# Altium project FKS-V2.3.PRJPCB
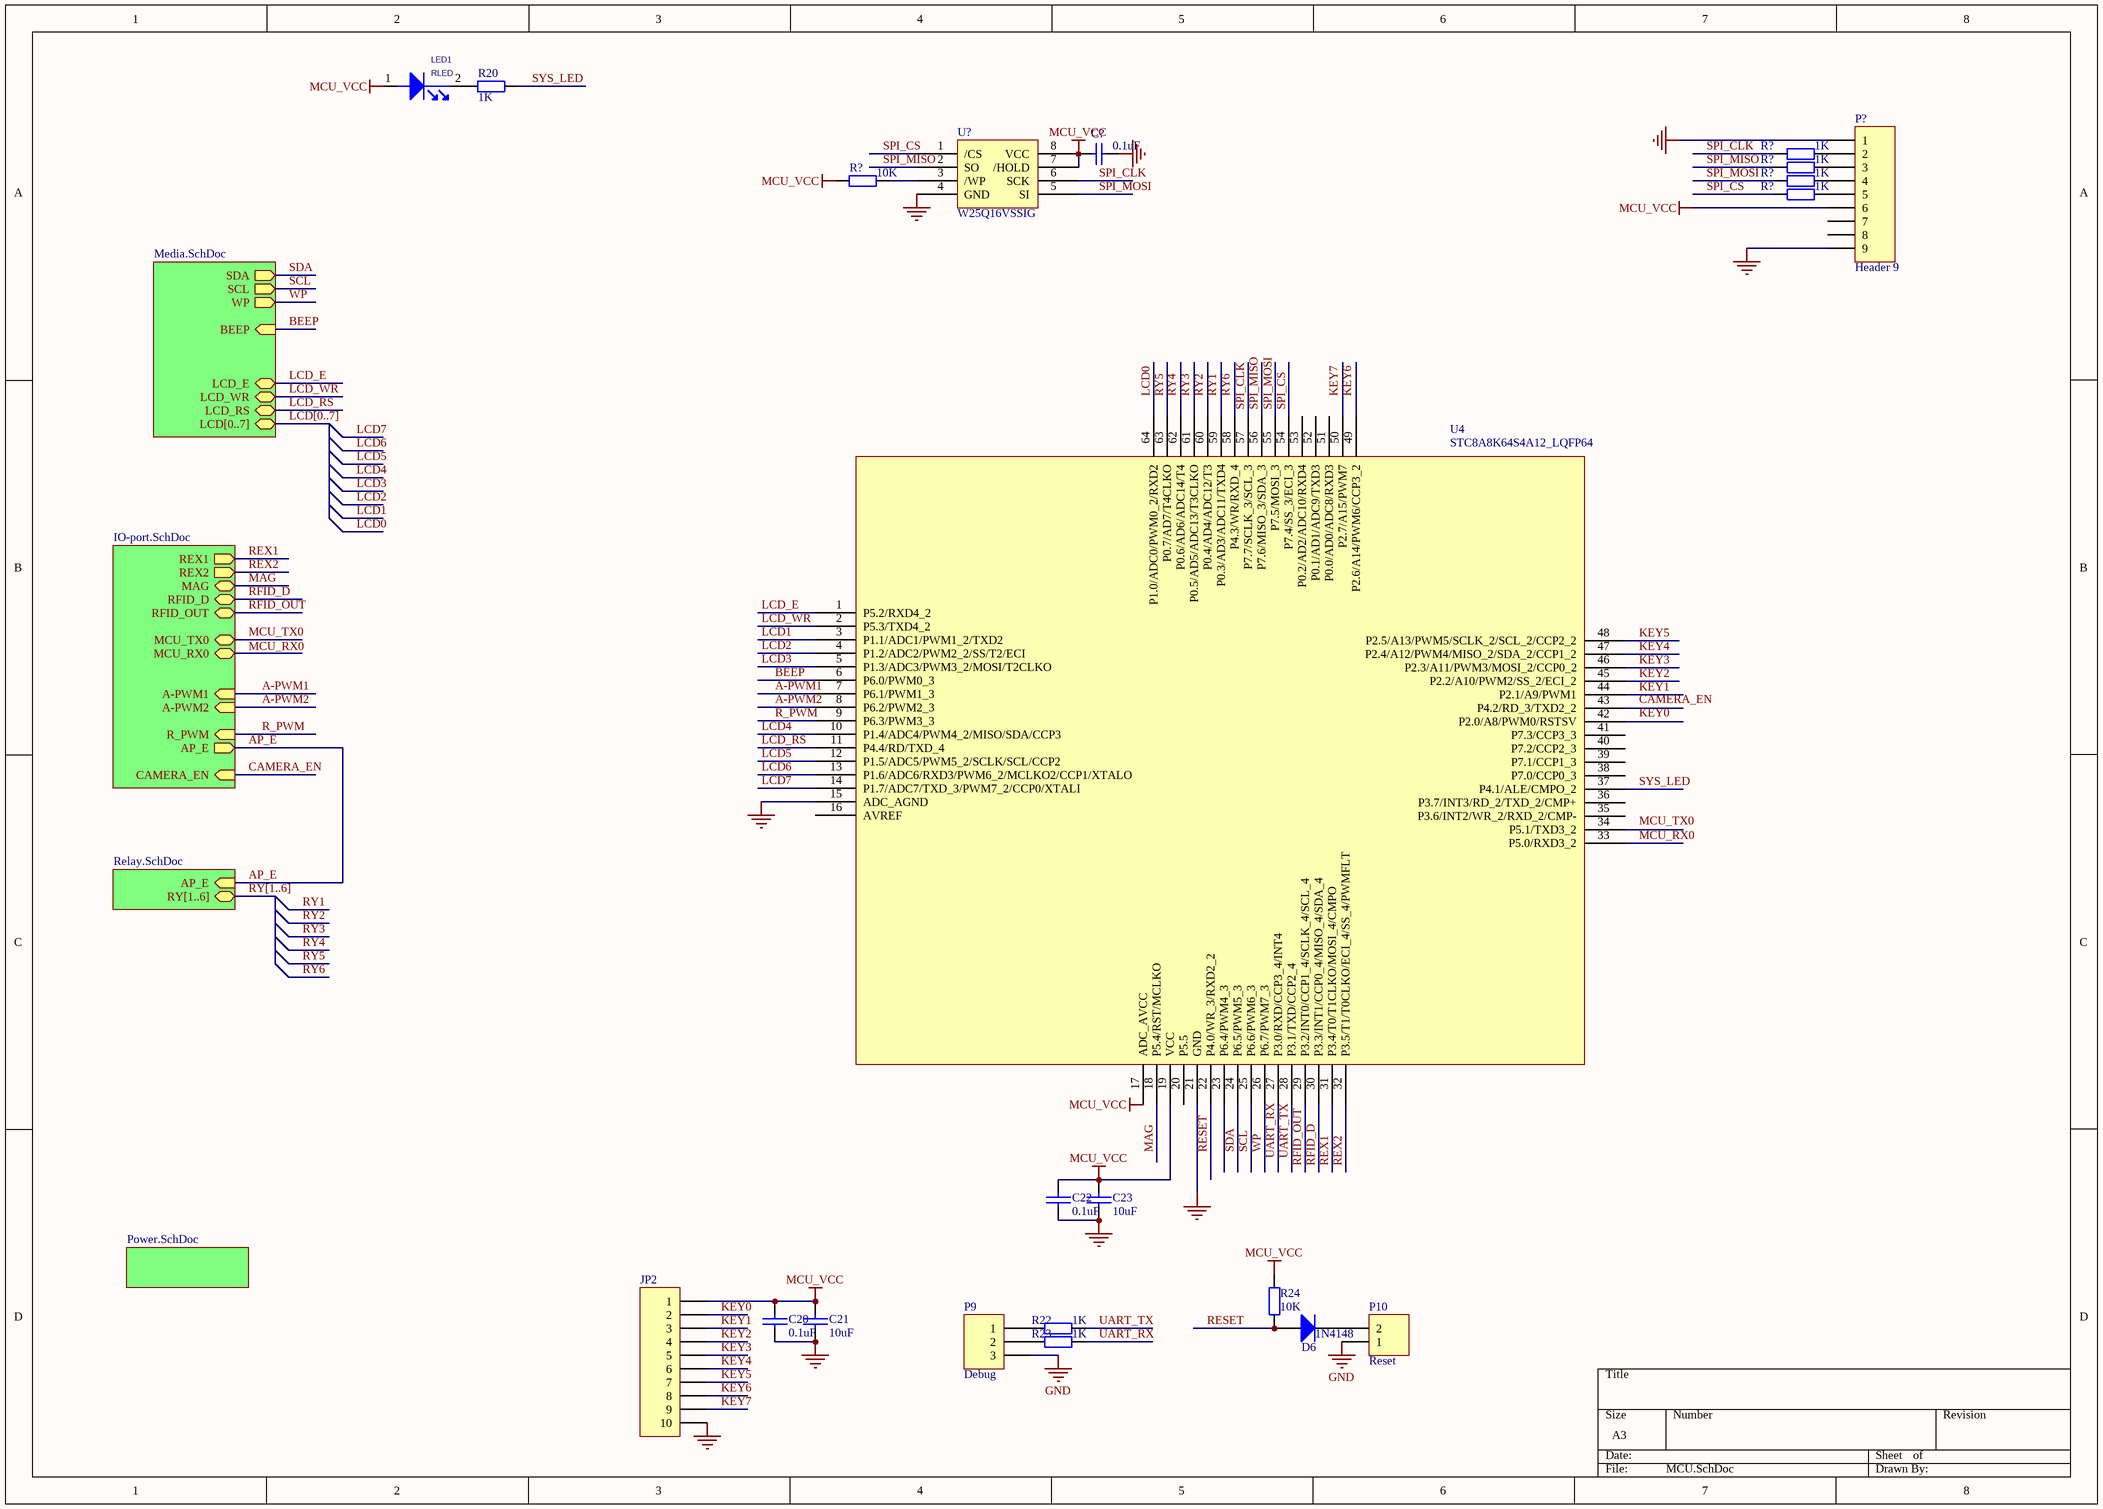
[diagram p0: MCU.SchDoc]
6 sheets, 181 parts. Net scope: hierarchical (ports join the sheet entries above them; power ports are global).
Sheets:
  MCU.SchDoc
    Media = Media.SchDoc
    Media = Power.SchDoc
    IO-port = IO-port.SchDoc
    Media = Relay.SchDoc
      RelayA1 = RelayA.SchDoc
      RelayA2 = RelayA.SchDoc
      RelayA3 = RelayA.SchDoc
      RelayA4 = RelayA.SchDoc
      RelayA5 = RelayA.SchDoc
      RelayA6 = RelayA.SchDoc
      RelayA7 = RelayA.SchDoc
      RelayA8 = RelayA.SchDoc
      RelayA9 = RelayA.SchDoc
      RelayA10 = RelayA.SchDoc
      RelayA11 = RelayA.SchDoc
      RelayA12 = RelayA.SchDoc
      RelayA13 = RelayA.SchDoc
      RelayA14 = RelayA.SchDoc
      RelayA15 = RelayA.SchDoc
      RelayA16 = RelayA.SchDoc

## Sheet MCU.SchDoc
size A3

### Parts
(Parts that share a designator on the sheet are numbered #1, #2 ... from top to bottom, then left to right.)
C20  0.1uF  [C0603]
C21  10uF  [C0603]
C22  0.1uF  [C0603]
C23  10uF  [C0603]
C?#1  0.1uF  [C0603]
D6  1N4148  [SO-G2]
JP2  (no value)  [HDR1X10]
LED1  RLED  [L0603A]
P9  Debug  [HDR1X3]
P10  Reset  [HDR1X2]
P?#1  Header 9  [HDR1X9]
R20  value 1K  [R1608-0603]  (hidden comment: 10K)
R22  1K  [R1608-0603]
R23  1K  [R1608-0603]
R24  value 10K  [R0603]
R?#1  1K  [R0603]
R?#2  1K  [R0603]
R?#3  10K  [R0603]
R?#4  1K  [R0603]
R?#5  1K  [R0603]
U4  STC8A8K64S4A12_LQFP64  [LQFP64]
U?#1  W25Q16VSSIG  [SOP8L]

### Sub-sheets
IO-port = IO-port.SchDoc: REX1 (out), RFID_OUT, MAG, MCU_TX0, MCU_RX0, AP_E (out), CAMERA_EN (in), A-PWM1 (in), A-PWM2 (in), R_PWM (in), REX2 (out), RFID_D
Media = Media.SchDoc: SDA (out), SCL (out), WP (out), LCD_E (bidir), LCD_WR (bidir), LCD_RS (bidir), LCD[0..7] (bidir), BEEP (in)
Media = Power.SchDoc: no entries
Media = Relay.SchDoc: RY[1..6] (bidir), AP_E (in)

### Nets
GND: C20.2 C21.2 C22.2 C23.2 C?#1.1 JP2.10 P9.3 P10.1 P?#1.1 P?#1.9 U4.15(ADC_AGND) U4.21(GND) U?#1.4(GND)
MCU_VCC: C20.1 C21.1 C22.1 C23.1 C?#1.2 JP2.1 LED1.1(ANODE) P?#1.6 R24.1 R?#3.2 U4.17(ADC_AVCC) U4.19(VCC) U?#1.7(/HOLD) U?#1.8(VCC)
A-PWM1: U4.7(P6.1/PWM1_3) ; sheet IO-port/A-PWM1
A-PWM2: U4.8(P6.2/PWM2_3) ; sheet IO-port/A-PWM2
AP_E: sheet IO-port/AP_E, sheet Media/AP_E
BEEP: U4.6(P6.0/PWM0_3) ; sheet Media/BEEP
KEY0: JP2.2
KEY1: JP2.3 U4.44(P2.1/A9/PWM1)
KEY2: JP2.4 U4.45(P2.2/A10/PWM2/SS_2/ECI_2)
KEY3: JP2.5 U4.46(P2.3/A11/PWM3/MOSI_2/CCP0_2)
KEY4: JP2.6 U4.47(P2.4/A12/PWM4/MISO_2/SDA_2/CCP1_2)
KEY5: JP2.7 U4.48(P2.5/A13/PWM5/SCLK_2/SCL_2/CCP2_2)
KEY6: JP2.8
KEY7: JP2.9
LCD0: U4.64(P1.0/ADC0/PWM0_2/RXD2)
LCD1: U4.3(P1.1/ADC1/PWM1_2/TXD2)
LCD2: U4.4(P1.2/ADC2/PWM2_2/SS/T2/ECI)
LCD3: U4.5(P1.3/ADC3/PWM3_2/MOSI/T2CLKO)
LCD4: U4.10(P1.4/ADC4/PWM4_2/MISO/SDA/CCP3)
LCD5: U4.12(P1.5/ADC5/PWM5_2/SCLK/SCL/CCP2)
LCD6: U4.13(P1.6/ADC6/RXD3/PWM6_2/MCLKO2/CCP1/XTALO)
LCD7: U4.14(P1.7/ADC7/TXD_3/PWM7_2/CCP0/XTALI)
LCD_E: U4.1(P5.2/RXD4_2) ; sheet Media/LCD_E
LCD_RS: U4.11(P4.4/RD/TXD_4) ; sheet Media/LCD_RS
LCD_WR: U4.2(P5.3/TXD4_2) ; sheet Media/LCD_WR
MAG: U4.18(P5.4/RST/MCLKO) ; sheet IO-port/MAG
MCU_RX0: U4.33(P5.0/RXD3_2)
R_PWM: U4.9(P6.3/PWM3_3) ; sheet IO-port/R_PWM
RESET: D6.A R24.2 U4.22(P4.0/WR_3/RXD2_2)
REX1: U4.31(P3.4/T0/T1CLKO/MOSI_4/CMPO) ; sheet IO-port/REX1
REX2: U4.32(P3.5/T1/T0CLKO/ECI_4/SS_4/PWMFLT) ; sheet IO-port/REX2
RFID_D: U4.30(P3.3/INT1/CCP0_4/MISO_4/SDA_4) ; sheet IO-port/RFID_D
RFID_OUT: U4.29(P3.2/INT0/CCP1_4/SCLK_4/SCL_4) ; sheet IO-port/RFID_OUT
RY5: U4.63(P0.7/AD7/T4CLKO)
SCL: U4.25(P6.6/PWM6_3) ; sheet Media/SCL
SDA: U4.24(P6.5/PWM5_3) ; sheet Media/SDA
SPI_CLK: R?#1.2 U4.57(P7.7/SCLK_3/SCL_3) U?#1.6(SCK)
SPI_CS: R?#5.2 U?#1.1(/CS)
SPI_MISO: R?#2.2 U4.56(P7.6/MISO_3/SDA_3) U?#1.2(SO)
SPI_MOSI: R?#4.2 U?#1.5(SI)
SYS_LED: R20.2 U4.37(P4.1/ALE/CMPO_2)
UART_RX: R23.1 U4.27(P3.0/RXD/CCP3_4/INT4)
UART_TX: R22.1 U4.28(P3.1/TXD/CCP2_4)
WP: U4.26(P6.7/PWM7_3) ; sheet Media/WP
NetD6_K: D6.K P10.2
NetLED1_2: LED1.2(CATHODE) R20.1
NetP9_1: P9.1 R22.2
NetP9_2: P9.2 R23.2
NetP?#1_2: P?#1.2 R?#1.1
NetP?#1_3: P?#1.3 R?#2.1
NetP?#1_4: P?#1.4 R?#4.1
NetP?#1_5: P?#1.5 R?#5.1
NetR?#3_1: R?#3.1 U?#1.3(/WP)

Not connected (* = marked no-connect by the designer): P?#1 7 8; U4 16(AVREF) 20(P5.5) 23(P6.4/PWM4_3) 34(P5.1/TXD3_2) 35(P3.6/INT2/WR_2/RXD_2/CMP-) 36(P3.7/INT3/RD_2/TXD_2/CMP+) 38(P7.0/CCP0_3) 39(P7.1/CCP1_3) 40(P7.2/CCP2_3) 41(P7.3/CCP3_3) 42(P2.0/A8/PWM0/RSTSV) 43(P4.2/RD_3/TXD2_2) 49(P2.6/A14/PWM6/CCP3_2) 50(P2.7/A15/PWM7) 51(P0.0/AD0/ADC8/RXD3) 52(P0.1/AD1/ADC9/TXD3) 53(P0.2/AD2/ADC10/RXD4) 54(P7.4/SS_3/ECI_3) 55(P7.5/MOSI_3) 58(P4.3/WR/RXD_4) 59(P0.3/AD3/ADC11/TXD4) 60(P0.4/AD4/ADC12/T3) 61(P0.5/AD5/ADC13/T3CLKO) 62(P0.6/AD6/ADC14/T4)

### Buses and harness runs
bus LCD[0..7] = sheet Media/LCD[0..7]
bus RY[1..6] = sheet Media/RY[1..6]

### Notes on the sheet
- Labels drawn without touching a wire or pin: CAMERA_EN, KEY0, KEY6, KEY7, MCU_RX0, MCU_TX0, RY1, RY2, RY3, RY4, RY6, SPI_CS, SPI_MOSI

### Library data of the parts
C20-C23 = CAP: Capacitor
  C20 C22: Value: 0.1uF
  C21 C23: Value: 10uF
C?#1 = Cap Semi: Capacitor (Semiconductor SIM Model); Published: 8-Jun-2000; LatestRevisionDate: 29-May-2009; LatestRevisionNote: IPC-7351 Footprint Added.; PackageReference: C1206; Publisher: Altium Limited; PackageDescription: Chip Capacitor; Value: 0.1uF
D6 = Diode 1N4001: 1 Amp General Purpose Rectifier; Published: 8-Jun-2000; LatestRevisionDate: 17-Jul-2002; LatestRevisionNote: Re-released for DXP Platform.; DatasheetVersion: 1998; PackageVersion: Aug-1999; PackageReference: DO-41; Publisher: Altium Limited; PackageDescription: Diode, Axial; Body 5.2 x 2.7 mm (LxDia. max), Lead Dia. 0.86 mm (max); Code_JEDEC: DO-204-AL; ComponentLink1Description: Manufacturer Link; ComponentLink1URL: http://www.fairchildsemi.com/; ComponentLink2Description: Datasheet; ComponentLink2URL: http://www.fairchildsemi.com/ds/1N%2F1N4001.pdf
JP2 = Header 10: Header, 10-Pin; LatestRevisionDate: 17-Jul-2002; LatestRevisionNote: Re-released for DXP Platform.; Publisher: Altium Limited
LED1 = LED_2
P9 = Header 3: Header, 3-Pin; LatestRevisionDate: 17-Jul-2002; LatestRevisionNote: Re-released for DXP Platform.; Publisher: Altium Limited
P10 = Header 2: Header, 2-Pin; LatestRevisionDate: 17-Jul-2002; LatestRevisionNote: Re-released for DXP Platform.; Publisher: Altium Limited
P?#1 = Header 9: Header, 9-Pin; LatestRevisionDate: 17-Jul-2002; LatestRevisionNote: Re-released for DXP Platform.; Publisher: Altium Limited
R20 R24 R?#1-R?#5 = Res2: Resistor; Published: 8-Jun-2000; LatestRevisionDate: 17-Jul-2002; LatestRevisionNote: Re-released for DXP Platform.; PackageReference: AXIAL-0.4; Publisher: Altium Limited
  R24: PackageDescription: Axial Device, Thru-Hole; 2 Leads; 0.4 in Pin Spacing
  R?#1 R?#2 R?#4 R?#5: PackageDescription: Axial Device, Thru-Hole; 2 Leads; 0.4 in Pin Spacing; Value: 1K
  R?#3: PackageDescription: Axial Device, Thru-Hole; 2 Leads; 0.4 in Pin Spacing; Value: 10K
R22 R23 = Res2: Resistor; Value: 2.4K; Published: 8-Jun-2000; LatestRevisionDate: 17-Jul-2002; LatestRevisionNote: Re-released for DXP Platform.; PackageReference: AXIAL-0.4; Publisher: Altium Limited
U?#1 = AT25256A: Serial EEPRom

## Sheet Media.SchDoc
size A4
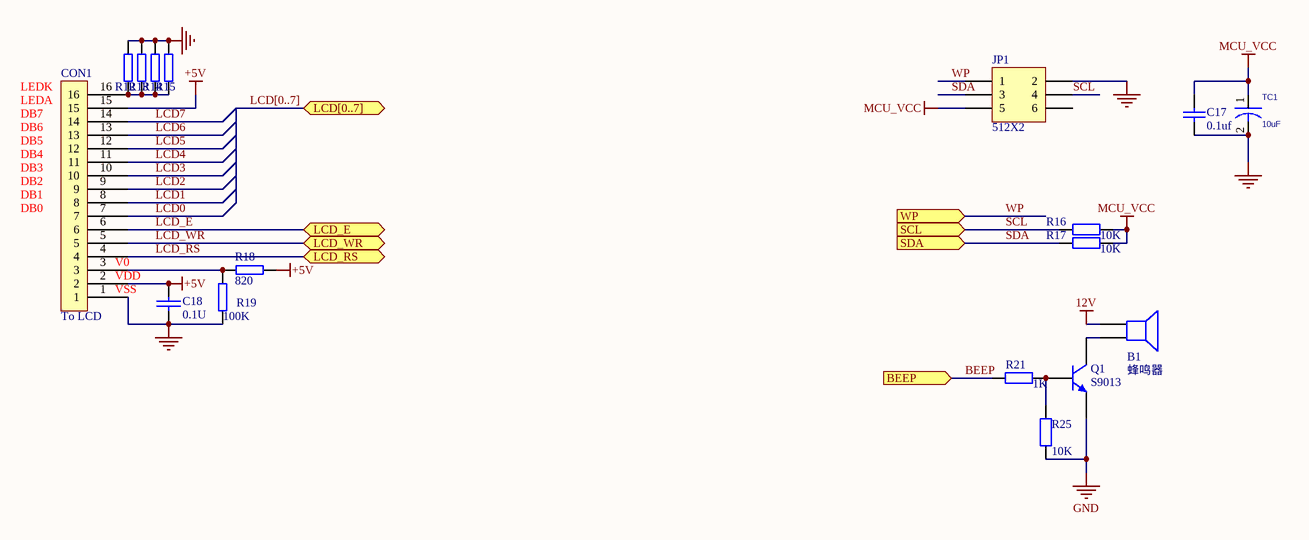
[diagram p1: Media.SchDoc]

### Parts
B1  蜂鸣器  [BP]
C17  0.1uf  [C1608-0603]
C18  0.1U  [c1608-0603]
CON1  To LCD  [RP16]
JP1  512X2  [HDR2X3]
Q1  S9013  [SOT-23]
R12  2K 1/4W  [R3216-1206]  (value not drawn)
R13  2K 1/4W  [R3216-1206]  (value not drawn)
R14  2K 1/4W  [R3216-1206]  (value not drawn)
R15  2K 1/4W  [R3216-1206]  (value not drawn)
R16  value 10K  [0603]
R17  value 10K  [0603]
R18  820  [r1608-0603]
R19  100K  [r1608-0603]
R21  value 1K  [R0603]
R25  value 10K  [R0603]
TC1  10uF  [C2125-0805]

### Ports
BEEP (in), LCD[0..7] (bidir), LCD_E (bidir), LCD_RS (bidir), LCD_WR (bidir), SCL (in), SDA (in), WP (in)

### Nets
12V: B1.1
+5V: C18.1 CON1.2 CON1.15 R18.2
GND: C17.1 C18.2 CON1.1 JP1.2 Q1.1(E) R12.2 R13.2 R14.2 R15.2 R19.2 R25.1 TC1.2
MCU_VCC: C17.2 JP1.5 R16.1 R17.1 TC1.1
BEEP: R21.1 ; port BEEP
LCD0: CON1.7
LCD1: CON1.8
LCD2: CON1.9
LCD3: CON1.10
LCD4: CON1.11
LCD5: CON1.12
LCD6: CON1.13
LCD7: CON1.14
LCD_E: CON1.6 ; port LCD_E
LCD_RS: CON1.4 ; port LCD_RS
LCD_WR: CON1.5 ; port LCD_WR
SCL: JP1.4 R16.2 ; port SCL
SDA: JP1.3 R17.2 ; port SDA
WP: JP1.1 ; port WP
NetB1_2: B1.2 Q1.3(C)
NetCON1_3: CON1.3 R18.1 R19.1
NetCON1_16: CON1.16 R12.1 R13.1 R14.1 R15.1
NetQ1_2: Q1.2(B) R21.2 R25.2

Not connected (* = marked no-connect by the designer): JP1 6

### Buses and harness runs
bus LCD[0..7] = port LCD[0..7]

### Notes on the sheet
- (near CON1) LEDK
- (near CON1) DB4
- (near CON1) DB5
- (near CON1) DB6
- (near CON1) DB7
- (near CON1) LEDA
- (near CON1) DB0
- (near CON1) DB1
- (near CON1) DB2
- (near CON1) DB3
- VSS
- VDD
- (near CON1) V0

### Library data of the parts
B1 = Speaker: Loudspeaker; Published: 24-Mar-1999; LatestRevisionDate: 17-Jul-2002; LatestRevisionNote: Re-released for DXP Platform.; PackageReference: PIN2; Publisher: Altium Limited
C17 = Cap Semi: Capacitor (Semiconductor SIM Model); Value: 22pF; Published: 8-Jun-2000; LatestRevisionDate: 17-Jul-2002; LatestRevisionNote: Re-released for DXP Platform.; PackageReference: C1206; Publisher: Altium Limited
C18 = CAP: Capacitor; Value: 0.1U
CON1 = CON16
JP1 = Header 3X2: Header, 3-Pin, Dual row; LatestRevisionDate: 17-Jul-2002; LatestRevisionNote: Re-released for DXP Platform.; Publisher: Altium Limited
Q1 = 2N3904: NPN General Purpose Amplifier; Published: 8-Jun-2000; LatestRevisionDate: 15-Jan-2003; LatestRevisionNote: PCB Footprint 'BCY-W3/D4.7' replaced; DatasheetVersion: 1997; PackageVersion: Sep-1998; PackageReference: TO-92A; Publisher: Altium Limited; PackageDescription: TO, Flat Index; 3 In-Line, Axial Leads; Body Dia. 4.5mm; Leads 0.51 x 0.48 mm (max); ComponentLink1Description: Manufacturer Link; ComponentLink1URL: http://www.fairchildsemi.com/; ComponentLink2Description: Datasheet; ComponentLink2URL: http://www.fairchildsemi.com/ds/2N%2F2N3904.pdf
R12-R15 R18 R19 = RES9: RES2
  R12-R15: Value: 2K 1/4W
  R18: Value: 820
  R19: Value: 100K
R16 R17 R21 R25 = Res2: Resistor; Published: 8-Jun-2000; LatestRevisionDate: 17-Jul-2002; LatestRevisionNote: Re-released for DXP Platform.; PackageReference: AXIAL-0.4; Publisher: Altium Limited; PackageDescription: Axial Device, Thru-Hole; 2 Leads; 0.4 in Pin Spacing
TC1 = CAP_0

## Sheet Power.SchDoc
size A4
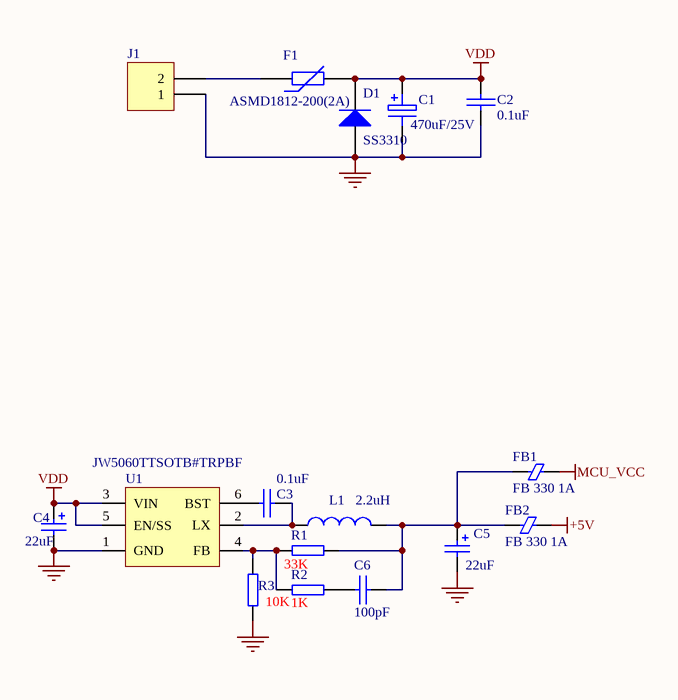
[diagram p2: Power.SchDoc]

### Parts
C1  470uF/25V  [TPC4-M]
C2  0.1uF  [C0603]
C3  0.1uF  [C0603]
C4  22uF  [C0603]
C5  22uF  [C0603]
C6  100pF  [C0603]
D1  SS3310  [SO-0.4]
F1  ASMD1812-200(2A)  [FS1812]
FB1  FB 330 1A  [R0603]
FB2  FB 330 1A  [R0603]
J1  Header 2  [JITE2_1]  (value not drawn)
L1  2.2uH  [2220]
R1  33K  [R0603]
R2  1K  [R0603]
R3  10K  [R0603]
U1  JW5060TTSOTB#TRPBF  [SOT23-6]

### Nets
+5V: FB2.2
GND: C1.2 C2.2 C4.2 C5.2 D1.A J1.1 R3.1 U1.1(GND)
MCU_VCC: FB1.2
VDD: C1.1 C2.1 C4.1 D1.K F1.2 U1.3(VIN) U1.5(EN/SS)
NetC3_1: C3.1 L1.1 U1.2(LX)
NetC3_2: C3.2 U1.6(BST)
NetC5_1: C5.1 C6.2 FB1.1 FB2.1 L1.2 R1.1
NetC6_1: C6.1 R2.1
NetF1_1: F1.1 J1.2
NetR1_2: R1.2 R2.2 R3.2 U1.4(FB)

### Library data of the parts
C1 = ELECTRO1: Electrolytic Capacitor; Value: 470uF/25V
C2 C3 C6 = CAP: Capacitor
  C2 C3: Value: 0.1uF
  C6: Value: 100pF
C4 C5 = Cap Pol2: Polarized Capacitor (Axial); Published: 8-Jun-2000; LatestRevisionDate: 17-Jul-2002; LatestRevisionNote: Re-released for DXP Platform.; PackageReference: POLAR0.8; Publisher: Altium Limited; Value: 22uF
D1 = Diode: Default Diode; Published: 8-Jun-2000; LatestRevisionDate: 17-Jul-2002; LatestRevisionNote: Re-released for DXP Platform.; PackageVersion: Sep-1996; PackageReference: SMC; Publisher: Altium Limited; PackageDescription: DO-214-AB/SMC; 2 C-Bend Leads; Body 7.9 x 5.9 mm, inc. leads (LxW); Code_JEDEC: DO-214-AB
F1 = Res Varistor: Varistor (Voltage-Sensitive Resistor); Published: 24-Mar-1999; LatestRevisionDate: 29-May-2009; LatestRevisionNote: IPC-7351 Footprint Added.; PackageVersion: Mar-2003; PackageReference: 6-0805; Publisher: Altium Limited; PackageDescription: Chip Resistor 0805 Case Size; Code_IPC: RESC2012
FB1 FB2 = FB: 磁珠电感100M
J1 = Header 2: Header, 2-Pin; LatestRevisionDate: 17-Jul-2002; LatestRevisionNote: Re-released for DXP Platform.; Publisher: Altium Limited
L1 = L: MS74-150MT; 型号: 2.2uH
R1-R3 = RES9: RES2
  R1: Value: 33K
  R2: Value: 1K
  R3: Value: 10K
U1 = XC9280

## Sheet IO-port.SchDoc
size A4
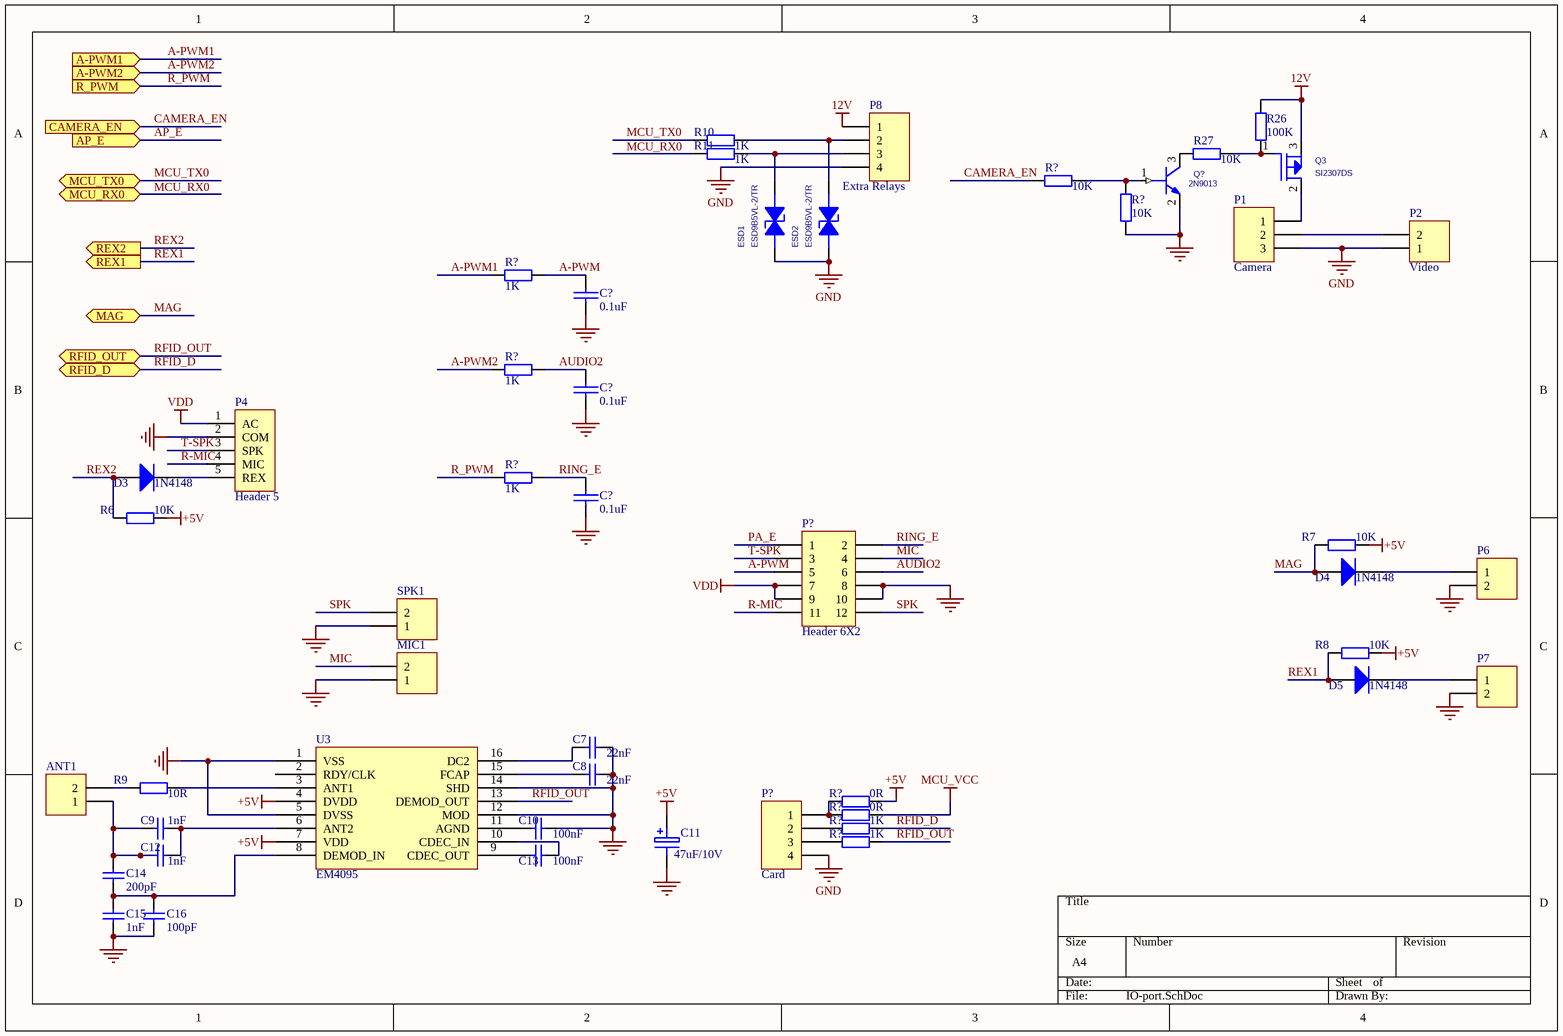
[diagram p3: IO-port.SchDoc]

### Parts
(Parts that share a designator on the sheet are numbered #1, #2 ... from top to bottom, then left to right.)
ANT1  (no value)  [SIP2]
C7  22nF  [C1608-0603]
C8  22nF  [C1608-0603]
C9  1nF  [C1608-0603]
C10  100nF  [C1608-0603]
C11  47uF/10V  [TPC4-M]
C12  1nF  [C1608-0603]
C13  100nF  [C1608-0603]
C14  200pF  [C1608-0603]
C15  1nF  [C1608-0603]
C16  100pF  [C1608-0603]
C?#2  0.1uF  [C0603]
C?#3  0.1uF  [C0603]
C?#4  0.1uF  [C0603]
D3  1N4148  [SO-G2]
D4  1N4148  [SO-G2]
D5  1N4148  [SO-G2]
ESD1  ESD9B5VL-2/TR  [SOD-323]
ESD2  ESD9B5VL-2/TR  [SOD-323]
MIC1  (no value)  [HDR1X2]
P1  Camera  [HDR1X3]
P2  Video  [SIP2]
P4  Header 5  [HDR1X5]
P6  Header 2  [SIP2]  (value not drawn)
P7  Header 2  [SIP2]  (value not drawn)
P8  Extra Relays  [SIP4]
P?#2  Header 6X2  [HDR2X6]
P?#3  Card  [HDR1X4]
Q3  SI2307DS  [SOT-23]
Q?#1  2N9013  [SOT-23]
R6  10K  [R1608-0603]
R7  10K  [R1608-0603]
R8  10K  [R1608-0603]
R9  value 10R  [R0603]
R10  value 1K  [R0603]
R11  value 1K  [R0603]
R26  value 100K  [R0603]
R27  value 10K  [R0603]
R?#6  value 10K  [R0603]
R?#7  value 10K  [R0603]
R?#8  value 1K  [R0603]
R?#9  value 1K  [R0603]
R?#10  value 1K  [R0603]
R?#11  0R  [R1608-0603]
R?#12  0R  [R1608-0603]
R?#13  1K  [R1608-0603]
R?#14  1K  [R1608-0603]
SPK1  (no value)  [HDR1X2]
U3  EM4095  [SOP16]

### Ports
A-PWM1 (in), A-PWM2 (in), AP_E (in), CAMERA_EN (in), MAG (bidir), MCU_RX0 (bidir), MCU_TX0 (bidir), R_PWM (in), REX1 (out), REX2 (out), RFID_D (bidir), RFID_OUT (bidir)

### Nets
12V: P8.1 Q3.3(SOURCE) R26.2
+5V: C11.1 R6.2 R7.2 R8.2 R?#11.1 U3.4(DVDD) U3.7(VDD)
GND: C7.1 C8.1 C10.1 C11.2 C15.2 C16.2 C?#2.2 C?#3.2 C?#4.2 ESD1.2(CATHODE) ESD2.2(CATHODE) MIC1.1 P1.3 P2.1 P4.2(COM) P6.2 P7.2 P8.4 P?#2.8 P?#2.10 P?#3.4 Q?#1.2(E) R?#7.1 SPK1.1 U3.1(VSS) U3.5(DVSS) U3.12(MOD) U3.14(SHD)
MCU_VCC: R?#12.1
VDD: P4.1(AC) P?#2.7 P?#2.9
A-PWM: C?#2.1 P?#2.5 R?#8.1
A-PWM1: R?#8.2 ; port A-PWM1
A-PWM2: R?#9.2 ; port A-PWM2
AUDIO2: C?#3.1 P?#2.6 R?#9.1
CAMERA_EN: R?#6.1 ; port CAMERA_EN
MAG: D4.A R7.1 ; port MAG
MCU_TX0: R10.1 ; port MCU_TX0
MIC: MIC1.2 P?#2.4
PA_E: P?#2.1
R-MIC: P4.4(MIC) P?#2.11
R_PWM: R?#10.2 ; port R_PWM
REX1: D5.A R8.1 ; port REX1
REX2: D3.A R6.1 ; port REX2
RFID_D: R?#13.1 ; port RFID_D
RFID_OUT: R?#14.1 U3.13(DEMOD_OUT) ; port RFID_OUT
RING_E: C?#4.1 P?#2.2 R?#10.1
SPK: P?#2.12 SPK1.2
T-SPK: P4.3(SPK) P?#2.3
NetANT1_1: ANT1.1 C9.2 C12.2 C14.1
NetANT1_2: ANT1.2 R9.2
NetC7_2: C7.2 U3.16(DC2)
NetC8_2: C8.2 U3.15(FCAP)
NetC9_1: C9.1 C12.1 U3.6(ANT2)
NetC10_2: C10.2 U3.11(AGND)
NetC13_1: C13.1 U3.10(CDEC_IN)
NetC13_2: C13.2 U3.9(CDEC_OUT)
NetC14_2: C14.2 C15.1 C16.1 U3.8(DEMOD_IN)
NetD3_K: D3.K P4.5(REX)
NetD4_K: D4.K P6.1
NetD5_K: D5.K P7.1
NetESD1_1: ESD1.1(ANODE) P8.3 R11.2
NetESD2_1: ESD2.1(ANODE) P8.2 R10.2
NetP1_1: P1.1 Q3.2(DRAIN)
NetP1_2: P1.2 P2.2
NetP?#3_1: P?#3.1 R?#11.2 R?#12.2
NetP?#3_2: P?#3.2 R?#13.2
NetP?#3_3: P?#3.3 R?#14.2
NetQ3_1: Q3.1(GATE) R26.1 R27.2
NetQ?#1_1: Q?#1.1(B) R?#6.2 R?#7.2
NetQ?#1_3: Q?#1.3(C) R27.1
NetR9_1: R9.1 U3.3(ANT1)

Not connected (* = marked no-connect by the designer): R11 1; U3 2(RDY/CLK)

### Notes on the sheet
- Labels drawn without touching a wire or pin: MCU_RX0

### Library data of the parts
ANT1 MIC1 P2 P6 P7 SPK1 = Header 2: Header, 2-Pin; LatestRevisionDate: 17-Jul-2002; LatestRevisionNote: Re-released for DXP Platform.; Publisher: Altium Limited
C7-C10 C12-C16 = Cap Semi: as C17 on sheet Media; Published: 8-Jun-2000; LatestRevisionDate: 17-Jul-2002; LatestRevisionNote: Re-released for DXP Platform.; PackageReference: C1206; Publisher: Altium Limited
C11 = ELECTRO1: Electrolytic Capacitor; Value: 47uF/10V
C?#2-C?#4 = CAP: Capacitor; Value: 0.1uF
D3-D5 = Diode 1N4148: High Conductance Fast Diode; Published: 8-Jun-2000; LatestRevisionDate: 17-Jul-2002; LatestRevisionNote: Re-released for DXP Platform.; DatasheetVersion: 1997; PackageReference: DO-35; Publisher: Altium Limited; PackageDescription: Diode, Axial; Body 3.8 x 1.9 mm (LxDia. max), Lead Dia. 0.53 mm (max); Code_JEDEC: DO-204-AH; ComponentLink1Description: Manufacturer Link; ComponentLink1URL: http://www.fairchildsemi.com/; ComponentLink2Description: Datasheet; ComponentLink2URL: http://www.fairchildsemi.com/ds/1N%2F1N4148.pdf
ESD1 ESD2 = 1_1.5KE100A_Dup1: 1ST PART DESCRIPTION: WILL ESD9B5V Bidirection ESD Protection
P1 = Header 3: Header, 3-Pin; LatestRevisionDate: 17-Jul-2002; LatestRevisionNote: Re-released for DXP Platform.; Publisher: Altium Limited
P4 = Header 5: Header, 5-Pin; LatestRevisionDate: 17-Jul-2002; LatestRevisionNote: Re-released for DXP Platform.; Publisher: Altium Limited
P8 P?#3 = Header 4: Header, 4-Pin; LatestRevisionDate: 17-Jul-2002; LatestRevisionNote: Re-released for DXP Platform.; Publisher: Altium Limited
P?#2 = Header 6X2: Header, 6-Pin, Dual row; LatestRevisionDate: 17-Jul-2002; LatestRevisionNote: Re-released for DXP Platform.; Publisher: Altium Limited
Q3 = MOSFET P_1
Q?#1 = NPN_0
R6-R8 R?#11-R?#14 = Res2: Resistor; Value: 2.4K; Published: 8-Jun-2000; LatestRevisionDate: 17-Jul-2002; LatestRevisionNote: Re-released for DXP Platform.; PackageReference: AXIAL-0.4; Publisher: Altium Limited
R9-R11 R26 R27 R?#6-R?#10 = Res2: Resistor; Published: 8-Jun-2000; LatestRevisionDate: 17-Jul-2002; LatestRevisionNote: Re-released for DXP Platform.; PackageReference: AXIAL-0.4; Publisher: Altium Limited; PackageDescription: Axial Device, Thru-Hole; 2 Leads; 0.4 in Pin Spacing

## Sheet Relay.SchDoc
size A4
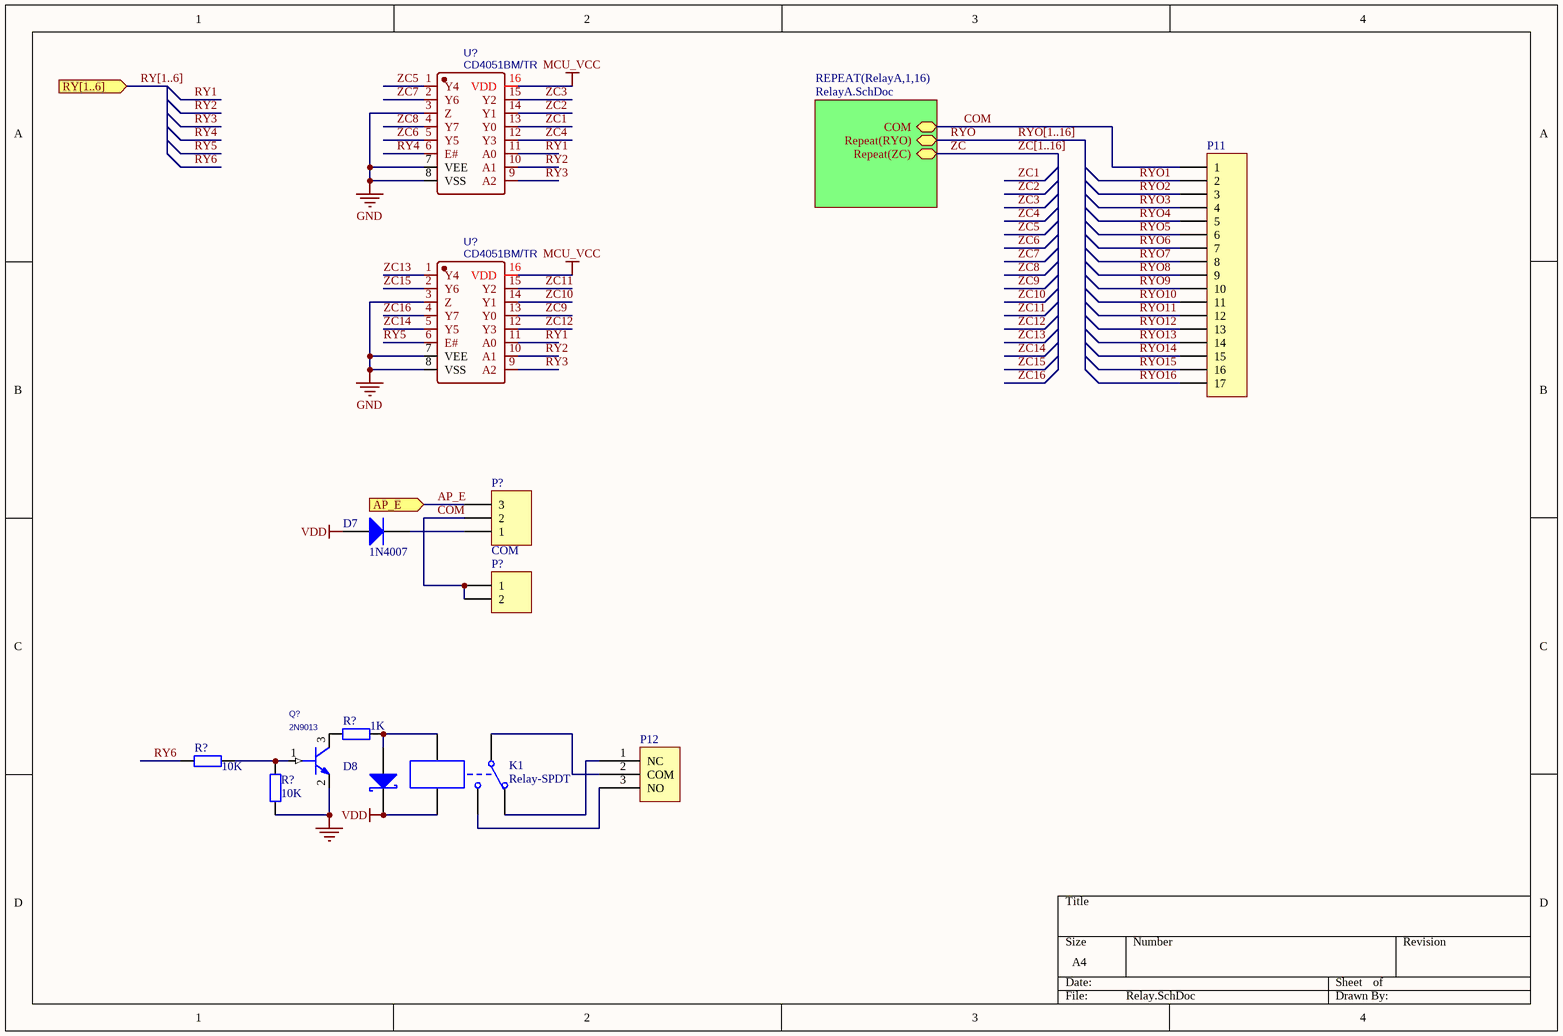
[diagram p4: Relay.SchDoc]

### Parts
(Parts that share a designator on the sheet are numbered #1, #2 ... from top to bottom, then left to right.)
D7  1N4007  [SO-0.4A]
D8  (no value)  [SO-0.4A]
K1  Relay-SPDT  [RELAY-TH_ZC-32F-012-ZS3-555]
P11  (no value)  [HDR1X17]
P12  (no value)  [HDR1X3]
P?#4  COM  [HDR1X3]
P?#5  Header 2  [SIP2]  (value not drawn)
Q?#2  2N9013  [SOT-23]
R?#15  value 1K  [R0603]
R?#16  value 10K  [R0603]
R?#17  value 10K  [R0603]
U?#2  CD4051BM/TR  [SOP-16_L9.9-W3.9-P1.27-LS6.1-BL]
U?#3  CD4051BM/TR  [SOP-16_L9.9-W3.9-P1.27-LS6.1-BL]

### Sub-sheets
REPEAT(RelayA,1,16) = RelayA.SchDoc: COM, Repeat(ZC) (bidir), Repeat(RYO) (bidir)

### Ports
AP_E (in), RY[1..6] (in)

### Nets
GND: Q?#2.2(E) R?#17.1 U?#2.3(Z) U?#2.7(VEE) U?#2.8(VSS) U?#3.3(Z) U?#3.7(VEE) U?#3.8(VSS)
MCU_VCC: U?#2.16(VDD) U?#3.16(VDD)
VDD: D7.A D8.K K1.5
AP_E: P?#4.3 ; port AP_E
COM: P11.1 P?#4.2 P?#5.1 P?#5.2 ; sheet REPEAT(RelayA,1,16)/COM
RY1: U?#2.11(A0) U?#3.11(A0)
RY2: U?#2.10(A1) U?#3.10(A1)
RY3: U?#2.9(A2) U?#3.9(A2)
RY4: U?#2.6(E#)
RY5: U?#3.6(E#)
RY6: R?#16.1
RYO: sheet REPEAT(RelayA,1,16)/Repeat(RYO)
RYO1: P11.2  [project net RYO]
RYO2: P11.3  [project net RYO]
RYO3: P11.4  [project net RYO]
RYO4: P11.5  [project net RYO]
RYO5: P11.6  [project net RYO]
RYO6: P11.7  [project net RYO]
RYO7: P11.8  [project net RYO]
RYO8: P11.9  [project net RYO]
RYO9: P11.10  [project net RYO]
RYO10: P11.11  [project net RYO]
RYO11: P11.12  [project net RYO]
RYO12: P11.13  [project net RYO]
RYO13: P11.14  [project net RYO]
RYO14: P11.15  [project net RYO]
RYO15: P11.16  [project net RYO]
RYO16: P11.17  [project net RYO]
ZC: sheet REPEAT(RelayA,1,16)/Repeat(ZC)
ZC1: U?#2.13(Y0)  [project net ZC]
ZC2: U?#2.14(Y1)  [project net ZC]
ZC3: U?#2.15(Y2)  [project net ZC]
ZC4: U?#2.12(Y3)  [project net ZC]
ZC5: U?#2.1(Y4)  [project net ZC]
ZC6: U?#2.5(Y5)  [project net ZC]
ZC7: U?#2.2(Y6)  [project net ZC]
ZC8: U?#2.4(Y7)  [project net ZC]
ZC9: U?#3.13(Y0)  [project net ZC]
ZC10: U?#3.14(Y1)  [project net ZC]
ZC11: U?#3.15(Y2)  [project net ZC]
ZC12: U?#3.12(Y3)  [project net ZC]
ZC13: U?#3.1(Y4)  [project net ZC]
ZC14: U?#3.5(Y5)  [project net ZC]
ZC15: U?#3.2(Y6)  [project net ZC]
ZC16: U?#3.4(Y7)  [project net ZC]
NetD7_K: D7.K P?#4.1
NetD8_A: D8.A K1.4 R?#15.2
NetK1_1: K1.1 P12.2(COM)
NetK1_2: K1.2 P12.1(NC)
NetK1_3: K1.3 P12.3(NO)
NetQ?#2_1: Q?#2.1(B) R?#16.2 R?#17.2
NetQ?#2_3: Q?#2.3(C) R?#15.1

### Buses and harness runs
bus RY[1..6] = port RY[1..6]
bus RYO[1..16]
bus ZC[1..16]

### Library data of the parts
D7 = Diode 1N4001: 1 Amp General Purpose Rectifier; Published: 8-Jun-2000; LatestRevisionDate: 17-Jul-2002; LatestRevisionNote: Re-released for DXP Platform.; DatasheetVersion: 1998; PackageVersion: Aug-1999; PackageReference: DO-41; Publisher: Altium Limited; PackageDescription: Diode, Axial; Body 5.2 x 2.7 mm (LxDia. max), Lead Dia. 0.86 mm (max); Code_JEDEC: DO-204-AL; ComponentLink1Description: Manufacturer Link; ComponentLink1URL: http://www.fairchildsemi.com/; ComponentLink2Description: Datasheet; ComponentLink2URL: http://www.fairchildsemi.com/ds/1N%2F1N4001.pdf
D8 = D Schottky: Schottky Diode; Published: 8-Jun-2000; LatestRevisionDate: 17-Jul-2002; LatestRevisionNote: Re-released for DXP Platform.; PackageReference: SMB; Publisher: Altium Limited; PackageDescription: DO-214-AA/SMB; 2 C-Bend Leads; Body 5.3 x 3.6 mm, inc. leads (LxW); Code_JEDEC: DO-214-AA
K1 = Relay-SPDT: Single-Pole Dual-Throw Relay; Published: 24-Mar-1999; LatestRevisionDate: 17-Jul-2002; LatestRevisionNote: Re-released for DXP Platform.; PackageReference: MODULE5B; Publisher: Altium Limited
P11 = Header 17: Header, 17-Pin; LatestRevisionDate: 17-Jul-2002; LatestRevisionNote: Re-released for DXP Platform.; Publisher: Altium Limited
P12 = Component_1
P?#4 = Header 3: Header, 3-Pin; LatestRevisionDate: 17-Jul-2002; LatestRevisionNote: Re-released for DXP Platform.; Publisher: Altium Limited
P?#5 = Header 2: Header, 2-Pin; LatestRevisionDate: 17-Jul-2002; LatestRevisionNote: Re-released for DXP Platform.; Publisher: Altium Limited
Q?#2 = NPN_0
R?#15-R?#17 = Res2: Resistor; Published: 8-Jun-2000; LatestRevisionDate: 17-Jul-2002; LatestRevisionNote: Re-released for DXP Platform.; PackageReference: AXIAL-0.4; Publisher: Altium Limited; PackageDescription: Axial Device, Thru-Hole; 2 Leads; 0.4 in Pin Spacing
U?#2 U?#3 = CD4051BM/TR: BOM_Manufacturer: HGSEMI; Contributor: LCSC; BOM_Supplier: LCSC; BOM_Supplier Part: C507163; BOM_Manufacturer Part: CD4051BM/TR; BOM_JLCPCB Part Class: Extended Part; spicePre: U; spiceSymbolName: CD4051BM/TR

## Sheet RelayA.SchDoc
size A4
Used 16 times, as channels Media/RelayA1, Media/RelayA2, Media/RelayA3, Media/RelayA4, Media/RelayA5, Media/RelayA6, Media/RelayA7, Media/RelayA8, Media/RelayA9, Media/RelayA10, Media/RelayA11, Media/RelayA12, Media/RelayA13, Media/RelayA14, Media/RelayA15, Media/RelayA16. Parts and nets are listed once, with the designators drawn on the sheet.
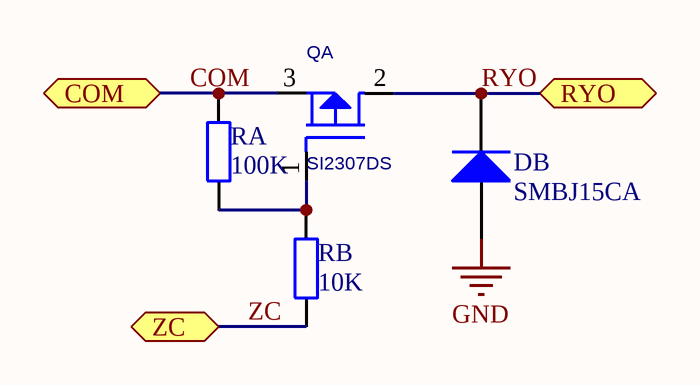
[diagram p5: RelayA.SchDoc]

### Parts
DB  SMBJ15CA  [SO-0.4A]
QA  SI2307DS  [SOT-23]
RA  value 100K  [R0603]
RB  value 10K  [R0603]

### Ports
COM (bidir), RYO (bidir), ZC (bidir)

### Nets
GND: DB.A
COM: QA.3(SOURCE) RA.2 ; port COM
RYO: DB.K QA.2(DRAIN) ; port RYO
ZC: RB.1 ; port ZC
NetQA_1: QA.1(GATE) RA.1 RB.2

### Channels
Media/RelayA1: designators end in 1; ports COM=COM RYO=RYO ZC=ZC
Media/RelayA2: designators end in 2; ports COM=COM RYO=RYO ZC=ZC
Media/RelayA3: designators end in 3; ports COM=COM RYO=RYO ZC=ZC
Media/RelayA4: designators end in 4; ports COM=COM RYO=RYO ZC=ZC
Media/RelayA5: designators end in 5; ports COM=COM RYO=RYO ZC=ZC
Media/RelayA6: designators end in 6; ports COM=COM RYO=RYO ZC=ZC
Media/RelayA7: designators end in 7; ports COM=COM RYO=RYO ZC=ZC
Media/RelayA8: designators end in 8; ports COM=COM RYO=RYO ZC=ZC
Media/RelayA9: designators end in 9; ports COM=COM RYO=RYO ZC=ZC
Media/RelayA10: designators end in 10; ports COM=COM RYO=RYO ZC=ZC
Media/RelayA11: designators end in 11; ports COM=COM RYO=RYO ZC=ZC
Media/RelayA12: designators end in 12; ports COM=COM RYO=RYO ZC=ZC
Media/RelayA13: designators end in 13; ports COM=COM RYO=RYO ZC=ZC
Media/RelayA14: designators end in 14; ports COM=COM RYO=RYO ZC=ZC
Media/RelayA15: designators end in 15; ports COM=COM RYO=RYO ZC=ZC
Media/RelayA16: designators end in 16; ports COM=COM RYO=RYO ZC=ZC

### Library data of the parts
DB = Diode 1N4001: 1 Amp General Purpose Rectifier; Published: 8-Jun-2000; LatestRevisionDate: 17-Jul-2002; LatestRevisionNote: Re-released for DXP Platform.; DatasheetVersion: 1998; PackageVersion: Aug-1999; PackageReference: DO-41; Publisher: Altium Limited; PackageDescription: Diode, Axial; Body 5.2 x 2.7 mm (LxDia. max), Lead Dia. 0.86 mm (max); Code_JEDEC: DO-204-AL; ComponentLink1Description: Manufacturer Link; ComponentLink1URL: http://www.fairchildsemi.com/; ComponentLink2Description: Datasheet; ComponentLink2URL: http://www.fairchildsemi.com/ds/1N%2F1N4001.pdf
QA = MOSFET P_1
RA RB = Res2: Resistor; Published: 8-Jun-2000; LatestRevisionDate: 17-Jul-2002; LatestRevisionNote: Re-released for DXP Platform.; PackageReference: AXIAL-0.4; Publisher: Altium Limited; PackageDescription: Axial Device, Thru-Hole; 2 Leads; 0.4 in Pin Spacing

## Nets that join several sheets
12V: Media (B1.1), IO-port (P8.1 Q3.3 R26.2)
+5V: Media (C18.1 CON1.2 CON1.15 R18.2), Power (FB2.2), IO-port (7 pins)
GND: MCU (13 pins), Media (12 pins), Power (8 pins), IO-port (28 pins), Relay (8 pins), Media/RelayA1 (DB1.A), Media/RelayA2 (DB2.A), Media/RelayA3 (DB3.A), Media/RelayA4 (DB4.A), Media/RelayA5 (DB5.A), Media/RelayA6 (DB6.A), Media/RelayA7 (DB7.A), Media/RelayA8 (DB8.A), Media/RelayA9 (DB9.A), Media/RelayA10 (DB10.A), Media/RelayA11 (DB11.A), Media/RelayA12 (DB12.A), Media/RelayA13 (DB13.A), Media/RelayA14 (DB14.A), Media/RelayA15 (DB15.A), Media/RelayA16 (DB16.A)
MCU_VCC: MCU (14 pins), Media (5 pins), Power (FB1.2), IO-port (R?#12.1), Relay (U?#2.16 U?#3.16)
VDD: Power (7 pins), IO-port (P4.1 P?#2.7 P?#2.9), Relay (D7.A D8.K K1.5)
A-PWM1: MCU (U4.7), IO-port (R?#8.2)
A-PWM2: MCU (U4.8), IO-port (R?#9.2)
BEEP: MCU (U4.6), Media (R21.1)
COM: Relay (P11.1 P?#4.2 P?#5.1 P?#5.2), Media/RelayA1 (QA1.3 RA1.2), Media/RelayA2 (QA2.3 RA2.2), Media/RelayA3 (QA3.3 RA3.2), Media/RelayA4 (QA4.3 RA4.2), Media/RelayA5 (QA5.3 RA5.2), Media/RelayA6 (QA6.3 RA6.2), Media/RelayA7 (QA7.3 RA7.2), Media/RelayA8 (QA8.3 RA8.2), Media/RelayA9 (QA9.3 RA9.2), Media/RelayA10 (QA10.3 RA10.2), Media/RelayA11 (QA11.3 RA11.2), Media/RelayA12 (QA12.3 RA12.2), Media/RelayA13 (QA13.3 RA13.2), Media/RelayA14 (QA14.3 RA14.2), Media/RelayA15 (QA15.3 RA15.2), Media/RelayA16 (QA16.3 RA16.2)
LCD0: MCU (U4.64), Media (CON1.7)
LCD1: MCU (U4.3), Media (CON1.8)
LCD2: MCU (U4.4), Media (CON1.9)
LCD3: MCU (U4.5), Media (CON1.10)
LCD4: MCU (U4.10), Media (CON1.11)
LCD5: MCU (U4.12), Media (CON1.12)
LCD6: MCU (U4.13), Media (CON1.13)
LCD7: MCU (U4.14), Media (CON1.14)
LCD_E: MCU (U4.1), Media (CON1.6)
LCD_RS: MCU (U4.11), Media (CON1.4)
LCD_WR: MCU (U4.2), Media (CON1.5)
MAG: MCU (U4.18), IO-port (D4.A R7.1)
R_PWM: MCU (U4.9), IO-port (R?#10.2)
REX1: MCU (U4.31), IO-port (D5.A R8.1)
REX2: MCU (U4.32), IO-port (D3.A R6.1)
RFID_D: MCU (U4.30), IO-port (R?#13.1)
RFID_OUT: MCU (U4.29), IO-port (R?#14.1 U3.13)
RY5: MCU (U4.63), Relay (U?#3.6)
RYO: Relay (P11.2), Media/RelayA1 (DB1.K QA1.2)
RYO: Relay (P11.3), Media/RelayA2 (DB2.K QA2.2)
RYO: Relay (P11.4), Media/RelayA3 (DB3.K QA3.2)
RYO: Relay (P11.5), Media/RelayA4 (DB4.K QA4.2)
RYO: Relay (P11.6), Media/RelayA5 (DB5.K QA5.2)
RYO: Relay (P11.7), Media/RelayA6 (DB6.K QA6.2)
RYO: Relay (P11.8), Media/RelayA7 (DB7.K QA7.2)
RYO: Relay (P11.9), Media/RelayA8 (DB8.K QA8.2)
RYO: Relay (P11.10), Media/RelayA9 (DB9.K QA9.2)
RYO: Relay (P11.11), Media/RelayA10 (DB10.K QA10.2)
RYO: Relay (P11.12), Media/RelayA11 (DB11.K QA11.2)
RYO: Relay (P11.13), Media/RelayA12 (DB12.K QA12.2)
RYO: Relay (P11.14), Media/RelayA13 (DB13.K QA13.2)
RYO: Relay (P11.15), Media/RelayA14 (DB14.K QA14.2)
RYO: Relay (P11.16), Media/RelayA15 (DB15.K QA15.2)
RYO: Relay (P11.17), Media/RelayA16 (DB16.K QA16.2)
SCL: MCU (U4.25), Media (JP1.4 R16.2)
SDA: MCU (U4.24), Media (JP1.3 R17.2)
WP: MCU (U4.26), Media (JP1.1)
ZC: Relay (U?#2.1), Media/RelayA5 (RB5.1)
ZC: Relay (U?#2.2), Media/RelayA7 (RB7.1)
ZC: Relay (U?#2.4), Media/RelayA8 (RB8.1)
ZC: Relay (U?#2.5), Media/RelayA6 (RB6.1)
ZC: Relay (U?#2.12), Media/RelayA4 (RB4.1)
ZC: Relay (U?#2.13), Media/RelayA1 (RB1.1)
ZC: Relay (U?#2.14), Media/RelayA2 (RB2.1)
ZC: Relay (U?#2.15), Media/RelayA3 (RB3.1)
ZC: Relay (U?#3.1), Media/RelayA13 (RB13.1)
ZC: Relay (U?#3.2), Media/RelayA15 (RB15.1)
ZC: Relay (U?#3.4), Media/RelayA16 (RB16.1)
ZC: Relay (U?#3.5), Media/RelayA14 (RB14.1)
ZC: Relay (U?#3.12), Media/RelayA12 (RB12.1)
ZC: Relay (U?#3.13), Media/RelayA9 (RB9.1)
ZC: Relay (U?#3.14), Media/RelayA10 (RB10.1)
ZC: Relay (U?#3.15), Media/RelayA11 (RB11.1)